# EAGLE design multicomm (EAGLE 7.2.0)
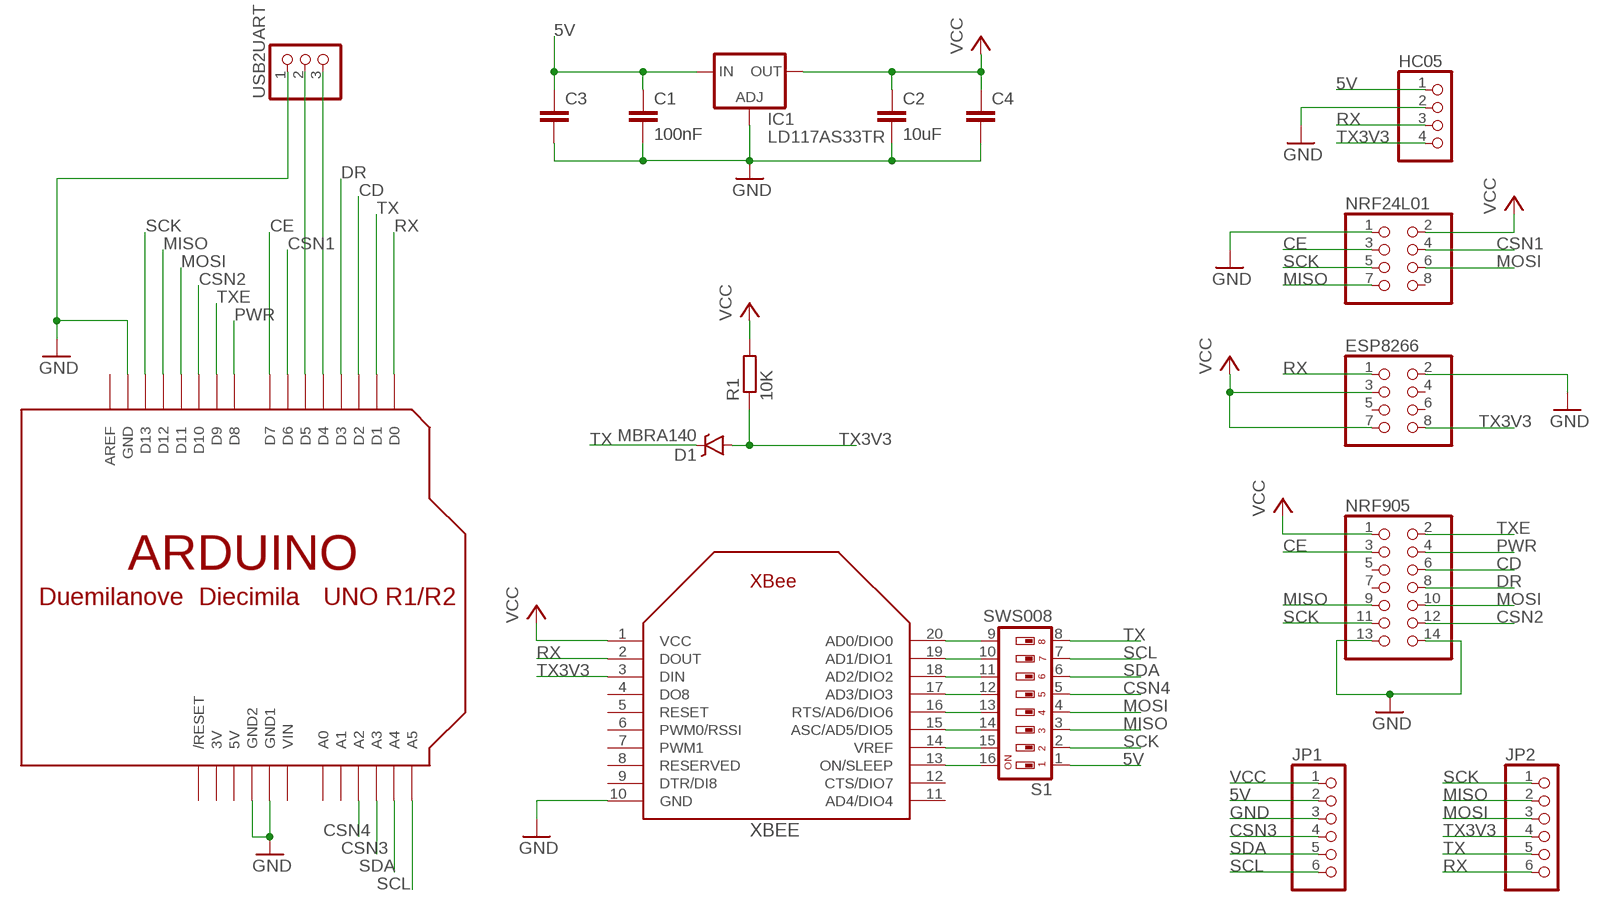
[diagram p0: schematic, sheet 1]

## Parts
C1  100nF  C-EUC1206  [C1206]
C2  10uF  C-EUC1206  [C1206]
C3  C-EUC1206  [C1206]
C4  C-EUC1206  [C1206]
D1  MBRA140  [SMA-DIODE]
ESP8266  PINHD-2X4  [2X04]
HC05  PINHD-1X4  [1X04]
IC1  LD117AS33TR  [SOT223]
JP1  PINHD-1X6  [1X06]
JP2  PINHD-1X6  [1X06]
NRF24L01  PINHD-2X4  [2X04]
NRF905  PINHD-2X7  [2X07]
R1  10K  R-EU_R1206  [R1206]
S1  SWS008  [SMS-008]
U$1  ARDUINO-NOHOLE  [ARDUINO-NOHOLE]
USB2UART  PINHD-1X3  [1X03]
XBEE  XBEE  [XBEE]

## Nets
5V: C1.1 C3.1 HC05.1 IC1.3(IN) JP1.2 S1.1
CD: NRF905.6 U$1.D2
CE: NRF24L01.3 NRF905.3 U$1.D7
CSN1: NRF24L01.4 U$1.D6
CSN2: NRF905.12 U$1.D10
CSN3: JP1.4 U$1.A3
CSN4: S1.5 U$1.A2
DR: NRF905.8 U$1.D3
GND: C1.2 C2.2 C3.2 C4.2 ESP8266.2 HC05.2 IC1.1(ADJ) JP1.3 NRF24L01.1 NRF905.13 NRF905.14 U$1.GND U$1.GND1 U$1.GND2 USB2UART.1 XBEE.10(GND)
MISO: JP2.2 NRF24L01.7 NRF905.9 S1.3 U$1.D12
MOSI: JP2.3 NRF24L01.6 NRF905.10 S1.4 U$1.D11
N$2: U$1.D4 USB2UART.3
N$3: U$1.D5 USB2UART.2
N$4: S1.9 XBEE.20(AD0/DIO0)
N$5: S1.10 XBEE.19(AD1/DIO1)
N$6: S1.11 XBEE.18(AD2/DIO2)
N$7: S1.12 XBEE.17(AD3/DIO3)
N$8: S1.13 XBEE.16(RTS/AD6/DIO6)
N$9: S1.14 XBEE.15(ASC/AD5/DIO5)
N$10: S1.15 XBEE.14(VREF)
N$11: S1.16 XBEE.13(ON/SLEEP)
PWR: NRF905.4 U$1.D8
RX: ESP8266.1 HC05.3 JP2.6 U$1.D0 XBEE.2(DOUT)
SCK: JP2.1 NRF24L01.5 NRF905.11 S1.2 U$1.D13
SCL: JP1.6 S1.7 U$1.A5
SDA: JP1.5 S1.6 U$1.A4
TX: D1.C JP2.5 S1.8 U$1.D1
TX3V3: D1.A ESP8266.8 HC05.4 JP2.4 R1.1 XBEE.3(DIN)
TXE: NRF905.2 U$1.D9
VCC: C2.1 C4.1 ESP8266.3 ESP8266.7 IC1.4(OUT) JP1.1 NRF24L01.2 NRF905.1 R1.2 XBEE.1(VCC)
Unconnected: ESP8266.4 ESP8266.5 ESP8266.6 NRF24L01.8 NRF905.5 NRF905.7 U$1.A0 U$1.A1 U$1.AREF U$1.RESET(/RESET) XBEE.4(DO8) XBEE.5(RESET) XBEE.6(PWM0/RSSI) XBEE.7(PWM1) XBEE.8(RESERVED) XBEE.9(DTR/DI8) XBEE.11(AD4/DIO4) XBEE.12(CTS/DIO7)

## Power pins joined to a net without a drawn wire
3V: U$1.3V
5V: U$1.5V
VIN: U$1.VIN

## Library data of the parts
C1-C4 = resistor:C-EU: CAPACITOR, European symbol
D1 = SparkFun-DiscreteSemi:MBRA140: 40V, 1A Schottky rectifier SMA/DO-214AC package DIO-08053; PROD_ID: DIO-08053
ESP8266 NRF24L01 = pinhead:PINHD-2X4: PIN HEADER
HC05 = pinhead:PINHD-1X4: PIN HEADER
IC1 = v-reg:LD117A?*: Low drop fixed and adjustable positive voltage regulators 1 A Source: http://www.st.com/stonline/products/literature/ds/7194/ld1117axx.pdf
JP1 JP2 = pinhead:PINHD-1X6: PIN HEADER
NRF905 = pinhead:PINHD-2X7: PIN HEADER
R1 = resistor:R-EU_: RESISTOR, European symbol
S1 = smd-special:SWS008: SMD Dip Switch 8 pol.
U$1 = adafruit:ARDUINO: Arduino Diecimila/Duemilanove Make a shield with ease, this package has all the named pins as well as the two mounting drill holes and an outline of the USB and DC power connector. The outline is on the DIMENSION layer, so if your board house uses it they will cut the outline to match. http://www.ladyada.net/library/pcb/eaglelibrary.html
USB2UART = pinhead:PINHD-1X3: PIN HEADER
XBEE = adafruit:XBEE

## Board
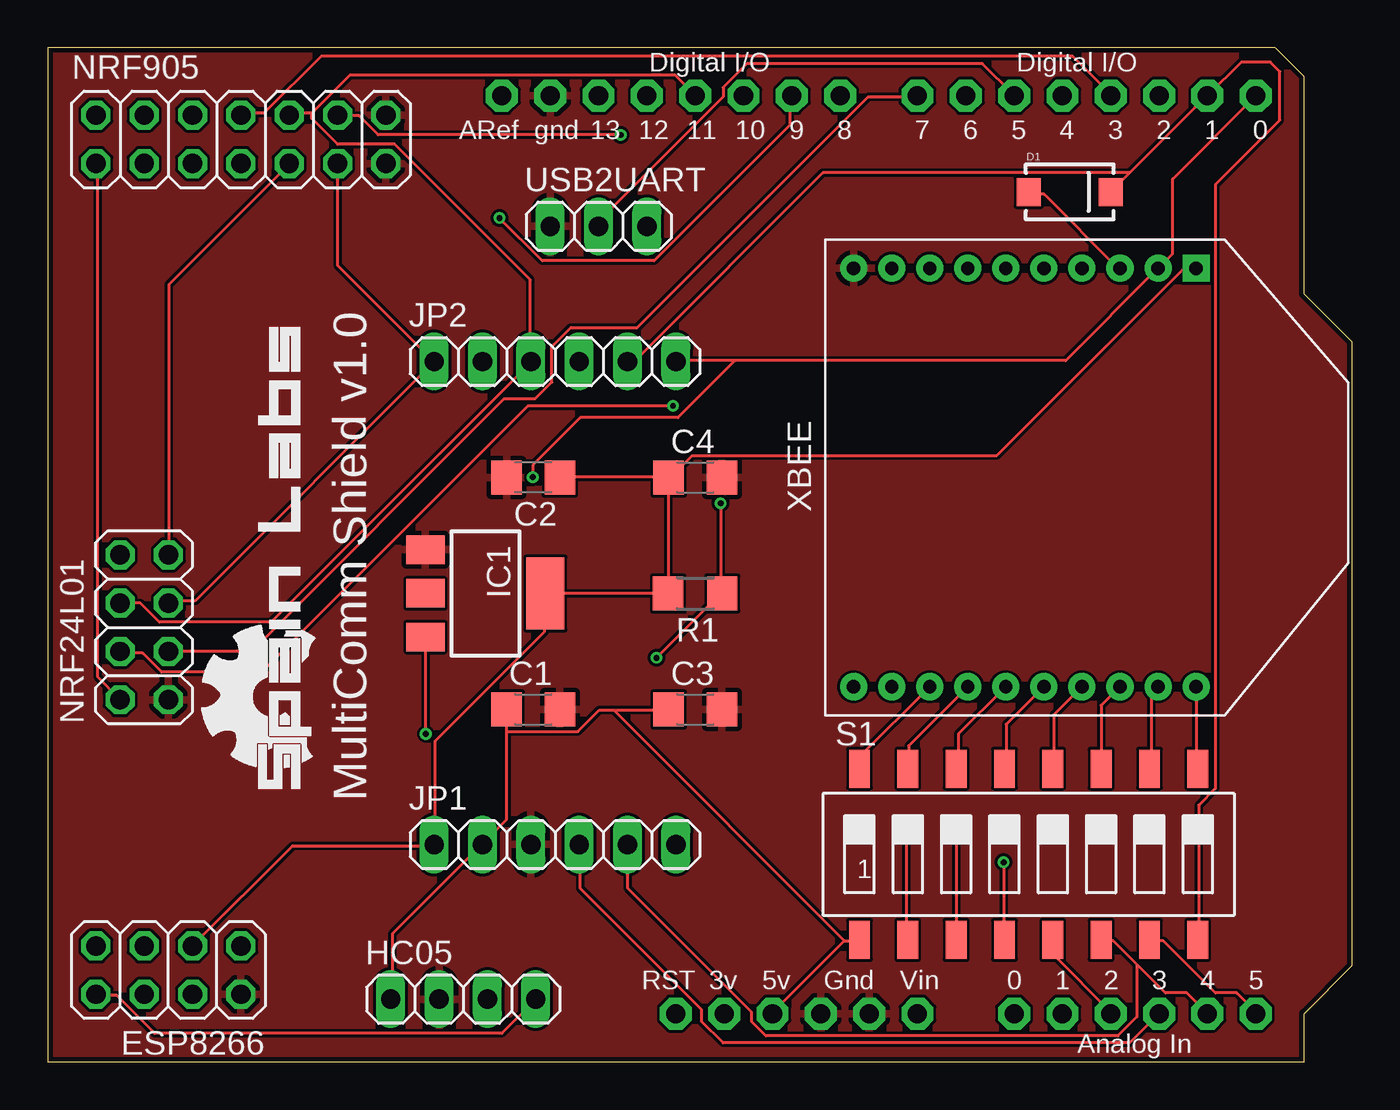
[diagram p1: board, top side]
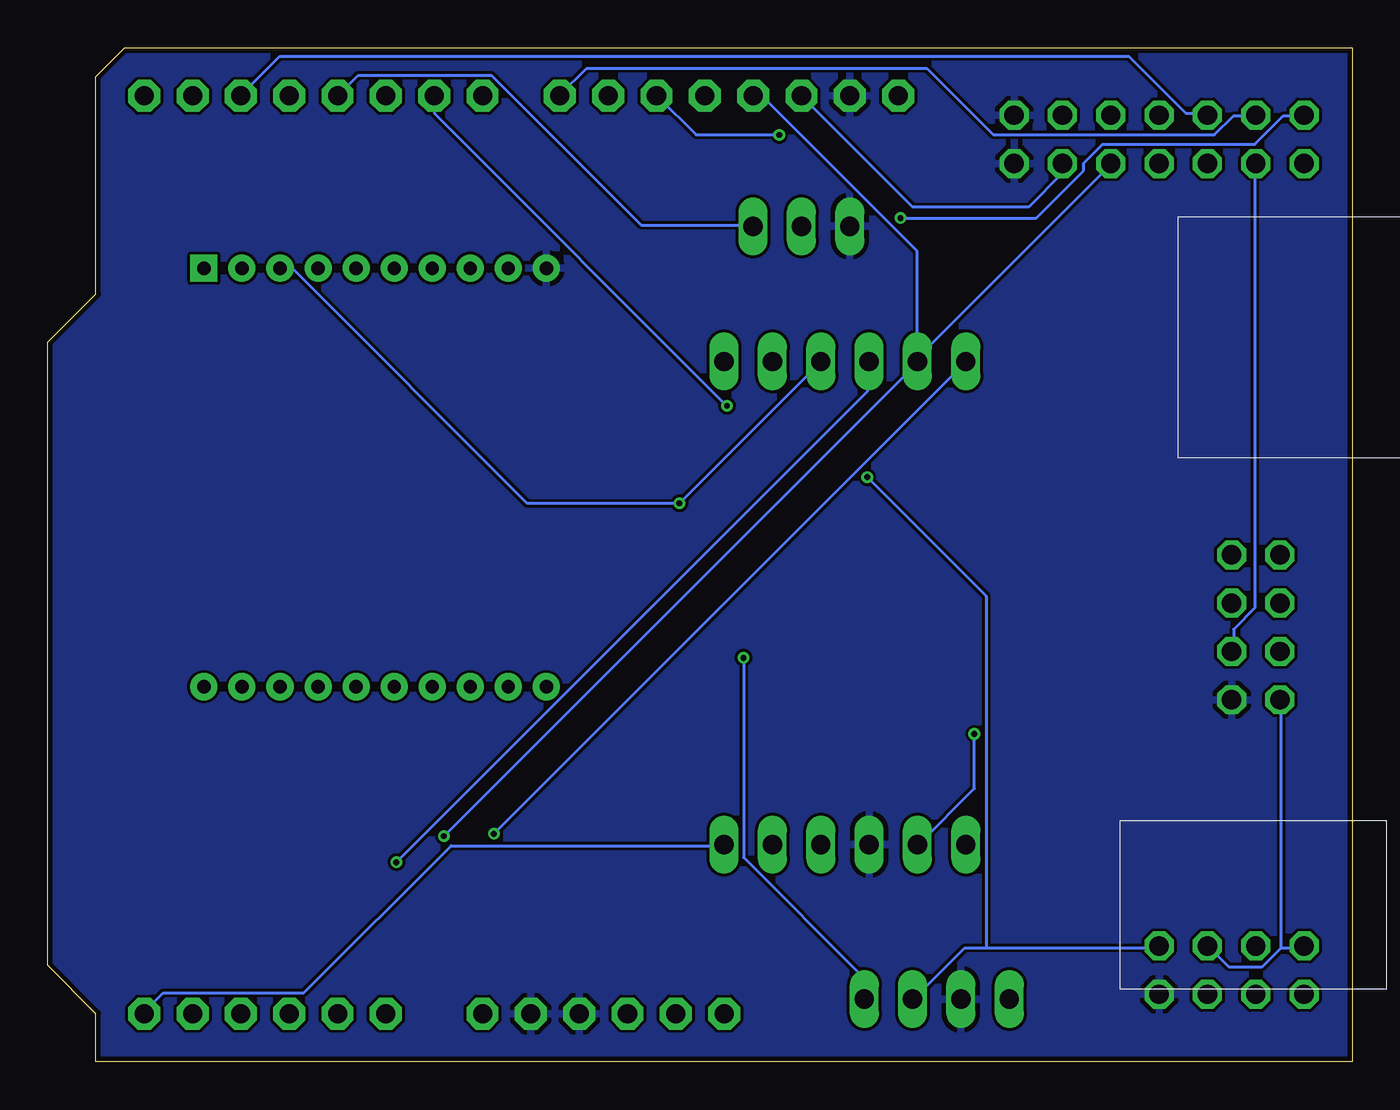
[diagram p2: board, bottom side, seen from below]

Size 68.58 x 53.34 mm. Coordinates in mm from the lower left corner, seen from the top.
Outline: 0,0 66.04,0 66.04,2.54 68.58,5.08 68.58,37.85 66.04,40.39 66.04,51.82 64.52,53.34 0,53.34 0,0
Copper layers (1*16): Top 0.035mm / dielectric 1.5mm / Bottom 0.035mm
Design rules "Elecrow_2-layer_eagle_rule": minimum track width 6mil, minimum drill 12mil, track to track 6mil, track to pad 6mil, pad to pad 6mil, via to via 6mil, smd to smd 0mil, copper to edge 10mil, drill to drill 10mil, minimum pad ring 10mil, minimum via ring 6mil, stop-mask expansion 2mil, vias tented up to drill 100mil, thermal gap 10mil

### Footprints (pad centres in the part's own frame; a part is rotated, then mirrored left to right if it is on the bottom)
C1206 = smd 1.6 x 1.8: 1 -1.4,0; 2 1.4,0
SMA-DIODE = smd 1.27 x 1.47: A -2.15,0; C 2.15,0
2X04 = drill 1.016 octagon: 1 -3.81,-1.27; 2 -3.81,1.27; 3 -1.27,-1.27; 4 -1.27,1.27; 5 1.27,-1.27; 6 1.27,1.27; 7 3.81,-1.27; 8 3.81,1.27
1X04 = drill 1.016 long: 1 -3.81,0; 2 -1.27,0; 3 1.27,0; 4 3.81,0
SOT223 = smd 1.5 x 2: 1 -2.3,-3.15; 2 0,-3.15; 3 2.3,-3.15 | smd 3.8 x 2: 4 0,3.15
1X06 = drill 1.016 long: 1 -6.35,0; 2 -3.81,0; 3 -1.27,0; 4 1.27,0; 5 3.81,0; 6 6.35,0
2X07 = drill 1.016 octagon: 1 -7.62,-1.27; 2 -7.62,1.27; 3 -5.08,-1.27; 4 -5.08,1.27; 5 -2.54,-1.27; 6 -2.54,1.27; 7 0,-1.27; 8 0,1.27; 9 2.54,-1.27; 10 2.54,1.27; 11 5.08,-1.27; 12 5.08,1.27; 13 7.62,-1.27; 14 7.62,1.27
R1206 = smd 1.6 x 1.803: 1 -1.422,0; 2 1.422,0
SMS-008 = smd 1.092 x 2.007: 1 -8.89,-4.496; 2 -6.35,-4.496; 3 -3.81,-4.496; 4 -1.27,-4.496; 5 1.27,-4.496; 6 3.81,-4.496; 7 6.35,-4.496; 8 8.89,-4.496; 9 8.89,4.496; 10 6.35,4.496; 11 3.81,4.496; 12 1.27,4.496; 13 -1.27,4.496; 14 -3.81,4.496; 15 -6.35,4.496; 16 -8.89,4.496
ARDUINO-NOHOLE = drill 1 pad 1.676 octagon: 3V 35.56,2.54; 5V 38.1,2.54; A0 50.8,2.54; A1 53.34,2.54; A2 55.88,2.54; A3 58.42,2.54; A4 60.96,2.54; A5 63.5,2.54; AREF 23.876,50.8; D0 63.5,50.8; D1 60.96,50.8; D2 58.42,50.8; D3 55.88,50.8; D4 53.34,50.8; D5 50.8,50.8; D6 48.26,50.8; D7 45.72,50.8; D8 41.656,50.8; D9 39.116,50.8; D10 36.576,50.8; D11 34.036,50.8; D12 31.496,50.8; D13 28.956,50.8; GND 26.416,50.8; GND1 43.18,2.54; GND2 40.64,2.54; RESET 33.02,2.54; VIN 45.72,2.54
1X03 = drill 1.016 long: 1 -2.54,0; 2 0,0; 3 2.54,0
XBEE = drill 0.7 pad 1.422 square: 1 -11,5.5 | drill 0.7 pad 1.422: 2 -11,3.5; 3 -11,1.5; 4 -11,-0.5; 5 -11,-2.5; 6 -11,-4.5; 7 -11,-6.5; 8 -11,-8.5; 9 -11,-10.5; 10 -11,-12.5; 11 11,-12.5; 12 11,-10.5; 13 11,-8.5; 14 11,-6.5; 15 11,-4.5; 16 11,-2.5; 17 11,-0.5; 18 11,1.5; 19 11,3.5; 20 11,5.5

### Placement (x,y rotation side)
C1  25.53,18.54 0 top
C2  25.53,30.73 180 top
C3  34.04,18.54 0 top
C4  34.04,30.73 0 top
D1  53.72,45.75 0 top
ESP8266  6.35,4.83 180 top
HC05  21.84,3.3 0 top
IC1  23.01,24.64 270 top
JP1  26.67,11.43 0 top
JP2  26.67,36.83 0 top
NRF24L01  5.08,22.86 90 top
NRF905  10.16,48.51 0 top
R1  34.04,24.64 180 top
S1  51.56,10.92 0 top
U$1  0,0 0 top
U$2  [SPAINLABS]  14.48,13.97 90 top
USB2UART  28.96,43.94 0 top
XBEE  54.86,30.73 270 top

### Tracks (layer width: path | path; a pad name or v marks a point on that pad's centre or on a via)
5V  (via drill 0.3)
  Top 0.152: 41.88,6.38 42.62,6.38 S1.1 | 41.88,6.38 38.12,2.62 U$1.5V | 24.12,17.38 24.12,12.75 22.88,11.5 JP1.2 22.75,11.38 18.12,6.75 18.12,3.38 HC05.1 | 24.12,17.38 24.12,18.5 C1.1 | 29.75,18.5 29,18.5 27.88,17.38 24.12,17.38 | 29.75,18.5 32.62,18.5 C3.1 | v19.88,17.25 19.88,22.25 IC1.3 | 29.75,18.5 41.88,6.38
  Bottom 0.152: v19.88,17.25 19.88,14.38 22.75,11.5 JP1.2
CD
  Bottom 0.152: NRF905.6 7.62,49.88 8.75,49.88 11.75,52.88 56.38,52.88 58.38,50.88 U$1.D2
CE
  Top 0.152: U$1.D7 45.62,50.75 43.12,50.75 31,38.62 27.5,38.62 26.5,37.62 26.5,35.75 25.62,34.88 24,34.88 10.75,21.62 6.38,21.62 NRF24L01.3
  Bottom 0.152: NRF24L01.3 6.25,21.62 6.25,22.75 5.12,23.88 5.12,47.12 NRF905.3
CSN1  (via drill 0.3)
  Top 0.152: v32.88,34.5 25.25,34.5 11.25,20.5 6,20.5 5,21.5 3.88,21.5 NRF24L01.4
  Bottom 0.152: v32.88,34.5 48.25,49.88 48.25,50.75 U$1.D6
CSN2  (via drill 0.3)
  Top 0.152: v30.12,48.75 17.38,48.75 16.38,49.75 15.25,49.75 NRF905.12
  Bottom 0.152: v30.12,48.75 34.5,48.75 36.5,50.75 U$1.D10
CSN3
  Top 0.152: JP1.4 28,11.38 28,9.12 34.38,2.75 34.38,2.12 35.5,1 56.88,1 58.38,2.5 U$1.A3
CSN4
  Top 0.152: S1.5 52.88,6.38 52.88,5.62 55.88,2.62 U$1.A2
DR
  Top 0.152: NRF905.8 10.25,49.88 11.38,49.88 14.38,52.88 53.88,52.88 55.88,50.88 U$1.D3
GND
  pour Top: 0,0 0,53.34 64.77,53.34 66.04,52.07 66.04,40.64 68.58,38.1 68.58,5.08 66.04,2.54 66.04,0
  pour Bottom: 0,0 0,53.34 64.77,53.34 66.04,52.07 66.04,40.64 68.58,38.1 68.58,5.08 66.04,2.54 66.04,0
MISO  (via drill 0.3)
  Top 0.152: NRF24L01.7 6.38,26.75 6.38,40.88 12.62,47.12 NRF905.9 | v47.75,11.88 47.75,6.5 S1.3
  Bottom 0.152: v47.75,11.88 22.88,36.75 JP2.2 | 22.88,37 22.88,36.88 JP2.2 | 22.88,37 22.88,42.62 31,50.75 31.38,50.75 U$1.D12 | 22.88,37 12.75,47.12 NRF905.9 | 22.88,37 JP2.2
MOSI  (via drill 0.3)
  Top 0.152: 13.88,49.88 12.75,49.88 NRF905.10 | 13.88,49.88 15.88,51.88 33,51.88 34,50.88 U$1.D11 | v50.25,10.5 50.25,6.5 S1.4 | NRF24L01.6 3.88,24.12 4.88,24.12 5.88,23.12 11.75,23.12 25.38,36.75 JP2.3 25.38,36.88 25.38,41.12 18.25,48.25 15.25,48.25 13.88,49.62 13.88,49.88
  Bottom 0.152: v50.25,10.5 25.5,35.25 25.5,36.75 JP2.3
N$2
  Bottom 0.152: USB2UART.3 31.5,44 37.38,44 45.25,51.88 52.25,51.88 53.25,50.88 U$1.D4
N$3
  Top 0.152: USB2UART.2 29,44 29,44.25 35.5,50.75 35.5,51.25 36.75,52.5 49.12,52.5 50.75,50.88 U$1.D5
N$4
  Top 0.152: S1.9 60.38,15.5 60.38,19.62 XBEE.20
N$5
  Top 0.152: S1.10 58,15.5 58,19.38 58.25,19.62 XBEE.19
N$6
  Top 0.152: S1.11 55.38,15.5 55.38,18.75 56.25,19.62 XBEE.18
N$7
  Top 0.152: S1.12 52.88,15.5 52.88,18.25 54.25,19.62 XBEE.17
N$8
  Top 0.152: S1.13 50.38,15.5 50.38,17.75 52.25,19.62 XBEE.16
N$9
  Top 0.152: S1.14 47.88,15.5 47.88,17.25 50.25,19.62 XBEE.15
N$10
  Top 0.152: S1.15 45.25,15.5 45.25,16.62 48.25,19.62 XBEE.14
N$11
  Top 0.152: S1.16 42.75,15.5 42.75,16.12 46.25,19.62 XBEE.13
PWR
  Bottom 0.152: NRF905.4 5.12,49.75 6.25,49.75 7.25,48.75 18.88,48.75 22.38,52.25 40.25,52.25 41.62,50.88 U$1.D8
RX  (via drill 0.3)
  Top 0.152: 36.12,36.88 53.5,36.88 58.25,41.62 XBEE.2 58.38,41.75 59.12,42.5 59.12,46.42 U$1.D0 | 36.12,36.88 33.12,36.88 JP2.6 | v25.5,30.75 25.5,31.38 28,33.88 33.12,33.88 36.12,36.88
  Bottom 0.152: 19.25,6 20.38,6 23,3.38 HC05.3 | 19.25,6 10.25,6 ESP8266.1 | 19.25,6 19.25,24.5 v25.5,30.75
SCK  (via drill 0.3)
  Top 0.152: v45.12,12 45.12,6.5 S1.2 | NRF24L01.5 6.38,24.25 7.75,24.25 20.25,36.75 JP2.1 20.25,36.88 15.25,41.88 15.25,47.12 NRF905.11
  Bottom 0.152: v45.12,12 20.38,36.75 JP2.1 | NRF905.11 15.25,47 | 15.24,46.99 15.24,46.74 17.02,44.96 23.11,44.96 U$1.D13
  Bottom 0.254: 15.25,47 15.24,46.99
SCL
  Top 0.152: S1.7 58,6.38 58.62,6.38 61.38,3.62 62.5,3.62 63.5,2.62 U$1.A5
  Bottom 0.152: JP1.6 33.12,11.38 47.38,11.38 55.12,3.62 62.5,3.62 63.5,2.62 U$1.A5
SDA
  Top 0.152: 57.25,5.12 58.75,3.62 59.88,3.62 U$1.A4 | 57.25,5.12 56,6.38 55.38,6.38 S1.6 | 57.25,5.12 57.25,2.38 56.25,1.38 37.75,1.38 37,2.12 37,2.62 30.5,9.12 30.5,11.38 JP1.5
TX
  Top 0.152: 56.88,46.75 60.88,50.75 U$1.D1 62.74,52.58 64.26,52.58 64.77,52.07 64.77,49.53 61.38,46.13 61.38,14.38 60.5,13.5 60.5,6.5 S1.8 | 56.88,46.75 D1.C | 56.88,46.75 40.75,46.75 30.88,36.88 30.5,36.88 JP2.5
TX3V3  (via drill 0.3)
  Top 0.152: ESP8266.8 2.62,3.5 3.62,3.5 5.62,1.5 23.88,1.5 25.62,3.25 HC05.4 | D1.A 51.62,45.62 52.38,45.62 56.25,41.75 XBEE.3 | v35.38,29.38 35.38,24.75 R1.1 35.38,24.62 v32,21.25
  Bottom 0.152: JP2.4 28,36.75 v35.38,29.38 43.38,29.38 55.62,41.62 56.25,41.62 XBEE.3 | v32,21.25 32,10.75 25.75,4.5 25.75,3.38 HC05.4
TXE  (via drill 0.3)
  Top 0.152: v23.75,44.38 26,42.12 31.88,42.12 39,49.25 39,50.75 U$1.D9
  Bottom 0.152: v23.75,44.38 16.62,44.38 14.12,46.88 14.12,47.25 13.12,48.25 5.12,48.25 3.62,49.75 2.62,49.75 NRF905.2
VCC
  Top 0.152: C2.1 27,30.75 32.62,30.75 C4.1 | C4.1 32.62,30.62 32.62,24.75 R1.2 32.5,24.62 26.25,24.62 IC1.4 26.12,24.62 26.12,22.62 20.38,16.88 20.38,11.5 JP1.1 20.25,11.38 12.88,11.38 7.62,6.12 ESP8266.3 | XBEE.1 60.25,41.62 59.62,41.62 49.88,31.88 33.88,31.88 32.75,30.75 C4.1 | NRF905.1 2.62,47.12 2.62,20.25 3.75,19.12 NRF24L01.2
  Bottom 0.152: 3.75,6 2.62,6 ESP8266.7 | 3.75,6 4.75,5 6.5,5 7.5,6 ESP8266.3 | 3.75,6 3.75,19 NRF24L01.2

### Text on the board
tPlace: MultiComm Shield v1.0